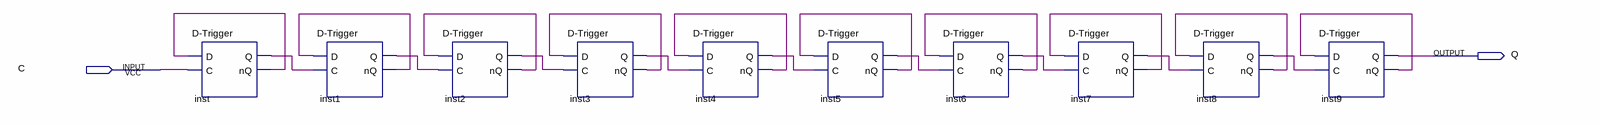
[diagram p0: schematic sheet]
// Quartus schematic D-Trigger10.bdf as structural Verilog: 10 symbols, 2 pins
module \D-Trigger10  (
  input  C,
  output Q
);

  wire inst1_nq, inst1_q, inst2_nq, inst2_q, inst3_nq, inst3_q, inst4_nq, inst4_q, inst5_nq, inst5_q,
       inst6_nq, inst6_q, inst7_nq, inst7_q, inst8_nq, inst8_q, inst9_nq, inst_nq, inst_q;

  \D-Trigger  inst (.D(inst_nq), .C(C), .Q(inst_q), .nQ(inst_nq));
  \D-Trigger  inst1 (.D(inst1_nq), .C(inst_q), .Q(inst1_q), .nQ(inst1_nq));
  \D-Trigger  inst2 (.D(inst2_nq), .C(inst1_q), .Q(inst2_q), .nQ(inst2_nq));
  \D-Trigger  inst3 (.D(inst3_nq), .C(inst2_q), .Q(inst3_q), .nQ(inst3_nq));
  \D-Trigger  inst4 (.D(inst4_nq), .C(inst3_q), .Q(inst4_q), .nQ(inst4_nq));
  \D-Trigger  inst5 (.D(inst5_nq), .C(inst4_q), .Q(inst5_q), .nQ(inst5_nq));
  \D-Trigger  inst6 (.D(inst6_nq), .C(inst5_q), .Q(inst6_q), .nQ(inst6_nq));
  \D-Trigger  inst7 (.D(inst7_nq), .C(inst6_q), .Q(inst7_q), .nQ(inst7_nq));
  \D-Trigger  inst8 (.D(inst8_nq), .C(inst7_q), .Q(inst8_q), .nQ(inst8_nq));
  \D-Trigger  inst9 (.D(inst9_nq), .C(inst8_q), .Q(Q), .nQ(inst9_nq));
endmodule
